# Altium schematic sheet RELAY_5V_3.3V_LEVEL.SchDoc
size 149 x 149 mm; SheetNumber: 8; SheetTotal: 13
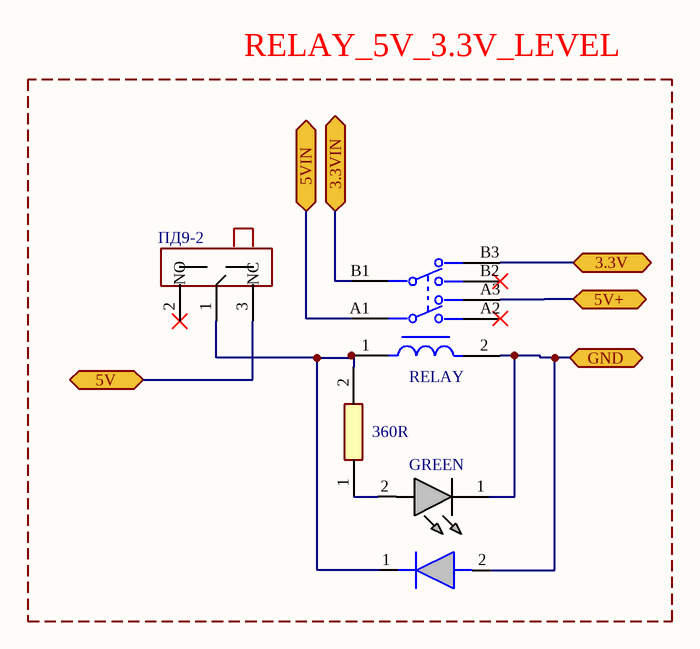
[diagram p0: RELAY_5V_3.3V_LEVEL.SchDoc]

## Parts
DIODRELE2  DIOD0805  [DIOD0805]  (value not drawn)
LEDRELE2  GREEN  [LED0805]
RELAY2  RELAY  [RELAY-5V]
RES_RELAY_2  360R  [RES0805]
ПД9-2RELE1  ПД9-2  [ПД9-2]

## Blocks framed on the sheet
RELAY_5V_3.3V_LEVEL: DIODRELE2 LEDRELE2 RELAY2 RES_RELAY_2 ПД9-2RELE1

## Ports
3.3V (bidir, see CONTROL_PCB_MAIN[2C]), 3.3VIN (bidir, see CONTROL_PCB_MAIN[3C], ADC1[2B], I2C[2A], I_O[1A], MOTORS[2B], SPI[1A], UARTSTM[2A]), 5V (bidir, see CONTROL_PCB_MAIN[2C]), 5V+ (bidir, see CONTROL_PCB_MAIN[2C]), 5VIN (bidir, see CONTROL_PCB_MAIN[3C], ADC1[2B], I2C[2A], I_O[1A], LEDS[1A], MOTORS[2B], SPI[1A], UARTSTM[2A]), GND (bidir, see CONTROL_PCB_MAIN[2C], ADC1[2D], CAN[2C], I2C[2D], I_O[1C], LEDS[1D], MOTORS[2D], RELAY_12VV_VDD_LEVEL[5B], SPI[1D], STM32[1D], UARTSTM[2D])

## Nets
3.3V: RELAY2.B3 ; port 3.3V
3.3VIN: RELAY2.B1 ; port 3.3VIN
5V: ПД9-2RELE1.3(NC) ; port 5V
5V+: RELAY2.A3 ; port 5V+
5VIN: RELAY2.A1 ; port 5VIN
GND: DIODRELE2.2(A) LEDRELE2.1(K) RELAY2.2(A2) ; port GND
NetDIODRELE2_1: DIODRELE2.1(K) RELAY2.1(A1) RES_RELAY_2.2 ПД9-2RELE1.1(COM)
NetLEDRELE2_2: LEDRELE2.2(A) RES_RELAY_2.1

Not connected (* = marked no-connect by the designer): RELAY2 A2(14)* B2(24)*; ПД9-2RELE1 2(NO)*

## Library data of the parts
DIODRELE2 = DIOD0805: 1N4448WS-7-F
LEDRELE2 = LED0805: LED-SMD0805
RELAY2 = RELAY-5V: R2G2CH005
RES_RELAY_2 = RES0805: RES-SMD0805